# Altium schematic sheet Sheet1.SchDoc
size A4
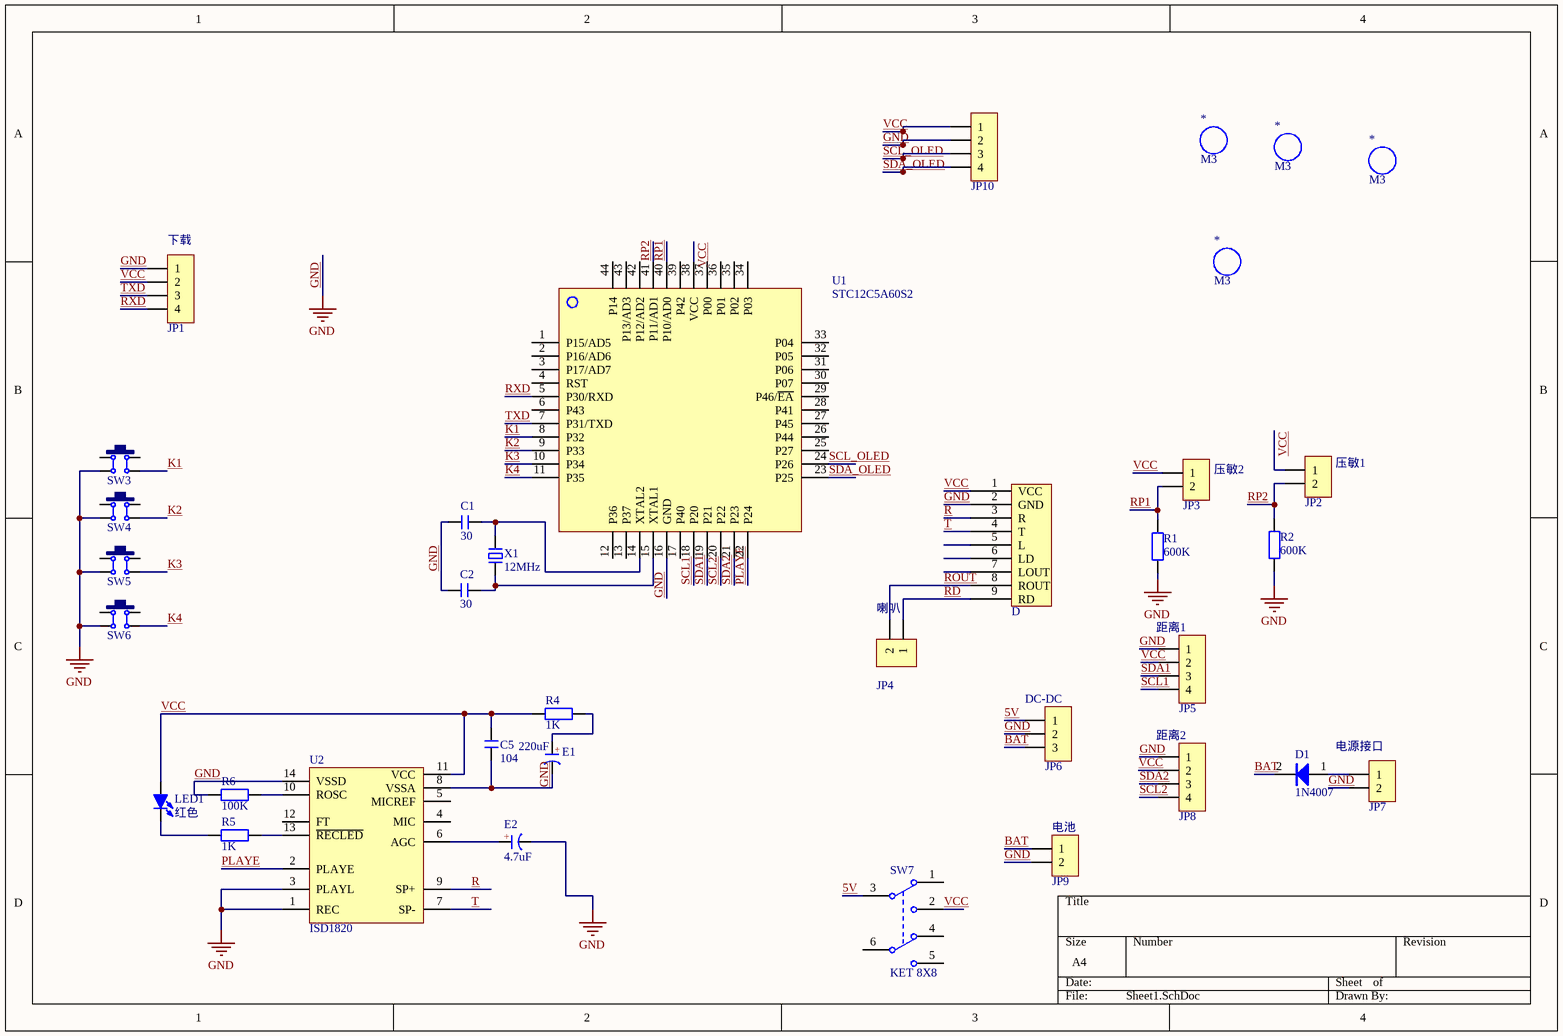
[diagram p0: Sheet1.SchDoc]

## Parts
(Parts that share a designator on the sheet are numbered #1, #2 ... from top to bottom, then left to right.)
*#1  M3  [M3 125X200]
*#2  M3  [M3 125X200]
*#3  M3  [M3 125X200]
*#4  M3  [M3 125X200]
C1  30  [C0805]
C2  30  [C0805]
C5  104  [C0805]
D  功放模块  [功放模块]  (value not drawn)
D1  1N4007  [SOD-123]
E1  220uF  [CAP 1.5*4*8]
E2  4.7uF  [CAP 1.5*4*8]
JP1  下载  [HDR2.54-LI-4P]
JP2  压敏1  [XH2.54-WI-2P]
JP3  压敏2  [XH2.54-WI-2P]
JP4  喇叭  [HDR2.54-LI-2P]
JP5  距离1  [XH2.54-WI-4P]
JP6  DC-DC  [HDR2.54-LI-3P]
JP7  电源接口  [KF301-2P-BLUE]
JP8  距离2  [XH2.54-WI-4P]
JP9  电池  [HDR2.54-LI-2P]
JP10  HDR-1X4  [HDR2.54-M-LI-4P]  (value not drawn)
LED1  红色  [LED 0805G]
R1  value 600K  [R0805]  (hidden comment: Resistor)
R2  value 600K  [R0805]  (hidden comment: Resistor)
R4  value 1K  [R0805]  (hidden comment: Resistor)
R5  value 1K  [R0805]  (hidden comment: Resistor)
R6  value 100K  [R0805]  (hidden comment: Resistor)
SW3  6x6x5  [TSW DIP-6*6*6]  (value not drawn)
SW4  6x6x5  [TSW DIP-6*6*6]  (value not drawn)
SW5  6x6x5  [TSW DIP-6*6*6]  (value not drawn)
SW6  6x6x5  [TSW DIP-6*6*6]  (value not drawn)
SW7  KET 8X8  [KFT DIP-8X8]
U1  STC12C5A60S2  [TQFP44 10x10_N]
U2  ISD1820  [DIP14]
X1  12MHz  [OSC HC-49SMD]

## Nets
GND: C1.2 C2.2 C5.1 D.2(GND) E1.2(K) E2.2(K) JP1.1 JP5.1 JP6.2 JP7.2 JP8.1 JP9.2 JP10.2 R1.1 R2.1 R6.1 SW3.4 SW4.4 SW5.4 SW6.4 U1.16(GND) U2.1(REC) U2.3(PLAYL) U2.8(VSSA) U2.14(VSSD)
5V: JP6.1 SW7.3(NO1)
BAT: D1.2(K) JP6.3 JP9.1
K1: SW3.3 U1.8(P32)
K2: SW4.3 U1.9(P33)
K3: SW5.3 U1.10(P34)
K4: SW6.3 U1.11(P35)
PLAYE: U1.22(P24) U2.2(PLAYE)
R: D.3(R) U2.9(SP+)
RD: D.9(RD) JP4.1
ROUT: D.8(ROUT) JP4.2
RP1: JP3.2 R1.2 U1.40(P10/AD0)
RP2: JP2.2 R2.2 U1.41(P11/AD1)
RXD: JP1.4 U1.5(P30/RXD)
SCL1: JP5.4 U1.18(P20)
SCL2: JP8.4 U1.20(P22)
SCL_OLED: JP10.3 U1.24(P26)
SDA1: JP5.3 U1.19(P21)
SDA2: JP8.3 U1.21(P23)
SDA_OLED: JP10.4 U1.23(P25)
T: D.4(T) U2.7(SP-)
TXD: JP1.3 U1.7(P31/TXD)
VCC: C5.2 D.1(VCC) JP1.2 JP2.1 JP3.1 JP5.2 JP8.2 JP10.1 LED1.1(A) R4.1 SW7.2(COM2) U1.38(VCC) U2.11(VCC)
NetC1_1: C1.1 U1.14(XTAL2) X1.2
NetC2_1: C2.1 U1.15(XTAL1) X1.1
NetD1_1: D1.1(A) JP7.1
NetE1_1: E1.1(A) R4.2
NetE2_1: E2.1(A) U2.6(AGC)
NetLED1_2: LED1.2(K) R5.1
NetR5_2: R5.2 U2.13(~{RECLED})
NetR6_2: R6.2 U2.10(ROSC)

Not connected (* = marked no-connect by the designer): D 5(L) 6(LD) 7(LOUT); SW3 1 2; SW4 1 2; SW5 1 2; SW6 1 2; SW7 1(NC1) 4(NO2) 5(COM2) 6(NC2); U1 1(P15/AD5) 2(P16/AD6) 3(P17/AD7) 4(RST) 6(P43) 12(P36) 13(P37) 17(P40) 25(P27) 26(P44) 27(P45) 28(P41) 29(P46/~{EA}) 30(P07) 31(P06) 32(P05) 33(P04) 34(P03) 35(P02) 36(P01) 37(P00) 39(P42) 42(P12/AD2) 43(P13/AD3) 44(P14); U2 4(MIC) 5(MICREF) 12(FT)

## Notes on the sheet
- (in symbol C-CAP) +

## Library data of the parts
*#1-*#4 = M3: 铜柱孔; 版权归属: 源创客; BOM名称: 铜柱孔; 学习资源: www.ooocke.com
C1 C2 C5 = C: 无极性贴片电容; 版权归属: 源创客; BOM名称: 无极性贴片电容; 学习资源: www.ooocke.com
D1 = 1N4007: 整流二极管; 版权归属: 源创客; BOM名称: 整流二极管; 学习资源: www.ooocke.com
E1 E2 = C-CAP: 直插电解电容; 版权归属: 源创客; BOM名称: 直插电解电容; 学习资源: www.ooocke.com
JP1 JP5 JP8 JP10 = Header 4: 4P接插件; 版权归属: 源创客; BOM名称: 4P接插件; 学习资源: www.ooocke.com
JP2-JP4 JP7 JP9 = Header 2: 2P接插件; 版权归属: 源创客; BOM名称: 2P接插件; 学习资源: www.ooocke.com
JP6 = Header 3: 3P接插件; 版权归属: 源创客; BOM名称: 3P接插件; 学习资源: www.ooocke.com
LED1 = LED-SMD: 贴片LED; 版权归属: 源创客; BOM名称: 贴片LED; 学习资源: www.ooocke.com
SW3-SW6 = TSW DIP-6x6: 直插6x6轻触开关; 版权归属: 源创客; BOM名称: 直插6x6轻触开关; 学习资源: www.ooocke.com
SW7 = KET 8X8: 8*8自锁开关; 版权归属: 源创客; BOM名称: 8*8自锁开关; 学习资源: www.ooocke.com
U1 = STC12C5A60S2: STC单片机; BOM名称: AVR单片机; 版权归属: 源创客; 学习资源: www.ooocke.com
U2 = ISD1820: 录音模块
X1 = XTAL-2P: 2脚无源脚晶振; 版权归属: 源创客; BOM名称: 2脚无源脚晶振; 学习资源: www.ooocke.com
R1 R2 R4-R6 = Resistor: Published: 8-Jun-2000; Revision: July-2002: Re-released for DXP Platform.; Publisher: Altium Limited